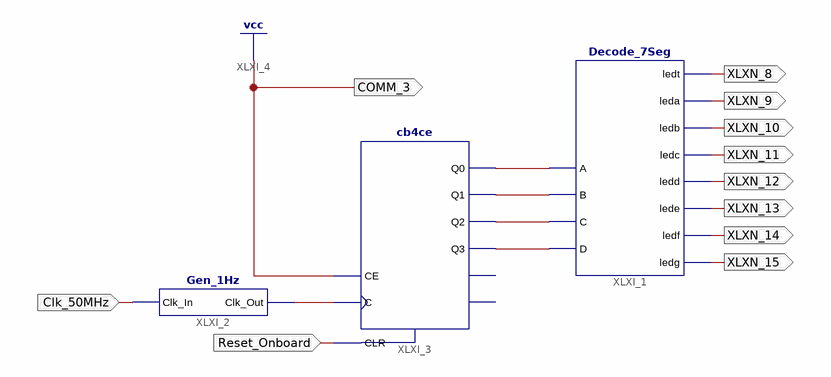
[diagram p0: schematic sheet 1]
// Xilinx ISE schematic XXXX.sch (spartan6) as structural Verilog: 3 symbols, 11 ports
module XXXX (
  input  Clk_50MHz,
  input  Reset_Onboard,
  output XLXN_8,
  output XLXN_9,
  output XLXN_10,
  output XLXN_11,
  output XLXN_12,
  output XLXN_13,
  output XLXN_14,
  output XLXN_15,
  output COMM_3
);

  wire XLXN_1, XLXN_2, XLXN_3, XLXN_4, XLXN_5;

  Decode_7Seg XLXI_1 (
    .B(XLXN_2), .ledt(XLXN_8), .leda(XLXN_9), .ledb(XLXN_10), .ledc(XLXN_11), .ledd(XLXN_12), .lede(XLXN_13),
    .ledf(XLXN_14), .ledg(XLXN_15), .A(XLXN_3), .C(XLXN_4), .D(XLXN_5));
  Gen_1Hz XLXI_2 (.Clk_In(Clk_50MHz), .Clk_Out(XLXN_1));
  cb4ce XLXI_3 (
    .C(XLXN_1), .CE(1'b1), .CLR(Reset_Onboard), .Q0(XLXN_3), .Q1(XLXN_2), .Q2(XLXN_4), .Q3(XLXN_5));  // open: CEO, TC

  assign COMM_3 = 1'b1;
endmodule
